# Altium schematic sheet Power_12v.SchDoc
size A
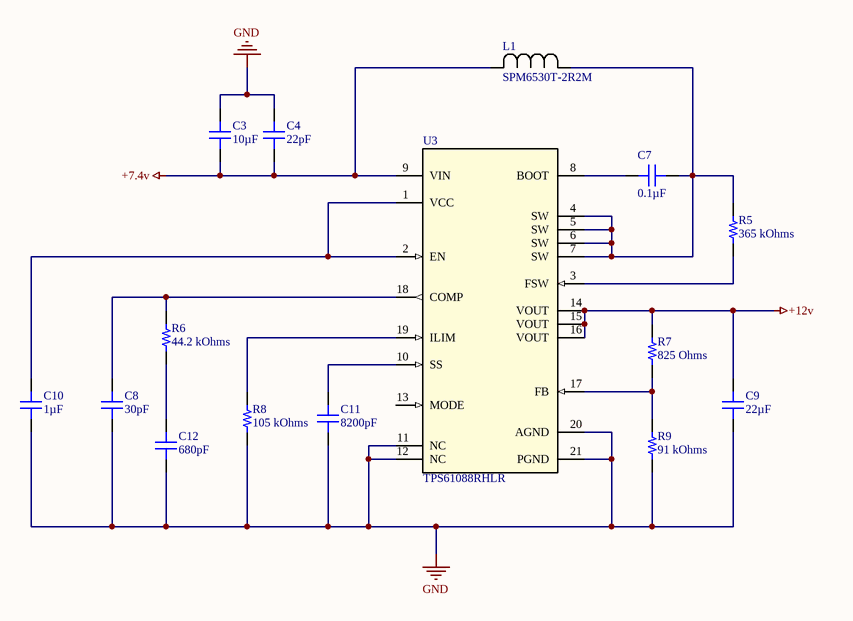
[diagram p0: Power_12v.SchDoc]

## Parts
C3  10µF  [CAP 1210_3225 - 2.8MM]
C4  22pF  [CAP 0603_1608]
C7  0.1µF  [CAP 0603_1608]
C8  value 30pF  [CAP 0603_1608]  (hidden comment: 22pF)
C9  22µF  [CAP 1210_3225 - 2.8MM]
C10  1µF  [CAP 0603_1608]
C11  value 8200pF  [CAP 0603_1608]  (hidden comment: 1µF)
C12  value 680pF  [CAP 0603_1608]  (hidden comment: 470pF)
L1  SPM6530T-2R2M  [IND_SPM6530_TDK]
R5  value 365 kOhms  [RES 0603_1608]  (hidden comment: 267 kOhms)
R6  value 44.2 kOhms  [RES 0603_1608]  (hidden comment: 36.5 kOhms)
R7  value 825 Ohms  [RES 0603_1608]  (hidden comment: 267 kOhms)
R8  105 kOhms  [RES 0603_1608]
R9  value 91 kOhms  [RES 0805_2012]  (hidden comment: 392 kOhms)
U3  TPS61088RHLR  [RHL0020A]

## Nets
+7.4v: C3.1 C4.1 L1.2 U3.9(VIN)
+12v: C9.2 R7.2 U3.14(VOUT) U3.15(VOUT) U3.16(VOUT)
GND: C3.2 C4.2 C8.1 C9.1 C10.1 C11.1 C12.1 R8.1 R9.2 U3.11(NC) U3.12(NC) U3.20(AGND) U3.21(PGND)
NetC7_1: C7.1 U3.8(BOOT)
NetC7_2: C7.2 L1.1 R5.2 U3.4(SW) U3.5(SW) U3.6(SW) U3.7(SW)
NetC8_2: C8.2 R6.2 U3.18(COMP)
NetC10_2: C10.2 U3.1(VCC) U3.2(EN)
NetC11_2: C11.2 U3.10(SS)
NetC12_2: C12.2 R6.1
NetR5_1: R5.1 U3.3(FSW)
NetR7_1: R7.1 R9.1 U3.17(FB)
NetR8_2: R8.2 U3.19(ILIM)

Not connected (* = marked no-connect by the designer): U3 13(MODE)

## Library data of the parts
C3 = GCJ32EC71H106KA01L: CAP CER 10UF 50V X7S 1210; Manufacturer: Murata Electronics; Tolerance: ±10%; Part Number: GCJ32EC71H106KA01L; Value: 10µF; Applications: Automotive, Boardflex Sensitive; Capacitance: 10µF; ComponentLink1Description: Datasheet; ComponentLink1URL: https://search.murata.co.jp/Ceramy/image/img/A01X/G101/ENG/GCJ32EC71H106KA01-01.pdf; ComponentLink2Description: DigiKey Link; ComponentLink2URL: http://digikey.com/product-detail/en/murata-electronics/GCJ32EC71H106KA01L/490-14418-1-ND/6606879; Device Package: 1210 (3225 Metric); Features: Soft Termination; LastUpdated: 9/2/2020 1:10:53 AM; Lifecycle Status: Active; Minimum Order: 1; Mounting Type: Surface Mount, MLCC; Operating Temperature: -55°C ~ 125°C; Package / Case: 1210 (3225 Metric); Packaging: TapeAndReel; PartId: 23622; Part Status: Active; Price: 0.53; Ratings: AEC-Q200; Series: GCJ; Size / Dimension: 0.126" L x 0.098" W (3.20mm x 2.50mm); Supplier 1: DigiKey; Supplier Part Number 1: 490-14418-1-ND; Temperature Coefficient: X7S; Thickness (Max): 0.110" (2.80mm); Voltage - Rated: 50V
C4 = 06033A220KAT2A: CAP CER 22PF 25V C0G/NP0 0603; Manufacturer: AVX Corporation; Temperature Coefficient: C0G, NP0; Tolerance: ±10%; Part Number: 06033A220KAT2A; Value: 22pF; Applications: General Purpose; Capacitance: 22pF; ComponentLink1Description: Datasheet; ComponentLink1URL: http://datasheets.avx.com/C0GNP0-Dielectric.pdf; ComponentLink2Description: DigiKey Link; ComponentLink2URL: http://digikey.com/product-detail/en/avx-corporation/06033A220KAT2A/478-11803-1-ND/8573439; Device Package: 0603 (1608 Metric); LastUpdated: 9/2/2020 1:03:34 AM; Lifecycle Status: Active; Minimum Order: 1; Mounting Type: Surface Mount, MLCC; Operating Temperature: -55°C ~ 125°C; Package / Case: 0603 (1608 Metric); Packaging: TapeAndReel; PartId: 3017; Part Status: Active; Price: 0.04; Series: -; Size / Dimension: 0.063" L x 0.032" W (1.60mm x 0.81mm); Supplier 1: DigiKey; Supplier Part Number 1: 478-11803-1-ND; Thickness (Max): 0.035" (0.90mm); Voltage - Rated: 25V
C7 = 0603YC104JAT4A: CAP CER 0.1UF 16V X7R 0603; Manufacturer: AVX Corporation; Tolerance: ±5%; Part Number: 0603YC104JAT4A; Value: 0.1µF; Applications: General Purpose; Capacitance: 0.1µF; ComponentLink1Description: Datasheet; ComponentLink1URL: http://datasheets.avx.com/X7RDielectric.pdf; ComponentLink2Description: DigiKey Link; ComponentLink2URL: http://digikey.com/product-detail/en/avx-corporation/0603YC104JAT4A/478-7621-1-ND/7536239; Device Package: 0603 (1608 Metric); LastUpdated: 9/2/2020 1:03:19 AM; Lifecycle Status: Active; Minimum Order: 1; Mounting Type: Surface Mount, MLCC; Operating Temperature: -55°C ~ 125°C; Package / Case: 0603 (1608 Metric); Packaging: TapeAndReel; PartId: 11638; Part Status: Active; Price: 0.03; Series: -; Size / Dimension: 0.063" L x 0.032" W (1.60mm x 0.81mm); Supplier 1: DigiKey; Supplier Part Number 1: 478-7621-1-ND; Temperature Coefficient: X7R; Thickness (Max): 0.035" (0.90mm); Voltage - Rated: 16V
C8 = C0805C300J5GACTU: CAP CER 30PF 50V C0G/NP0 0805; Manufacturer: KEMET; Temperature Coefficient: C0G, NP0; Tolerance: ±5%; Part Number: C0805C300J5GACTU; Applications: General Purpose; Capacitance: 30pF; ComponentLink1Description: Datasheet; ComponentLink1URL: https://api.kemet.com/component-edge/download/datasheet/C0805C300J5GACTU.pdf; ComponentLink2Description: DigiKey Link; ComponentLink2URL: http://digikey.com/product-detail/en/kemet/C0805C300J5GACTU/399-9219-1-ND/3522737; Device Package: 0805 (2012 Metric); Features: Low ESL; LastUpdated: 9/2/2020 1:04:20 AM; Lifecycle Status: Active; Minimum Order: 1; Mounting Type: Surface Mount, MLCC; Operating Temperature: -55°C ~ 125°C; Package / Case: 0805 (2012 Metric); Packaging: TapeAndReel; PartId: 14047; Part Status: Active; Price: 0.06; Series: SMD Comm C0G; Size / Dimension: 0.079" L x 0.049" W (2.00mm x 1.25mm); Supplier 1: DigiKey; Supplier Part Number 1: 399-9219-1-ND; Thickness (Max): 0.035" (0.88mm); Voltage - Rated: 50V
C9 = GRM32ER71E226ME15K: CAP CER 22UF 25V X7R 1210; Manufacturer: Murata Electronics; Tolerance: ±20%; Part Number: GRM32ER71E226ME15K; Value: 22µF; Applications: General Purpose; Capacitance: 22µF; ComponentLink1Description: Datasheet; ComponentLink1URL: https://search.murata.co.jp/Ceramy/image/img/A01X/G101/ENG/GRM32ER71E226ME15-01.pdf; ComponentLink2Description: DigiKey Link; ComponentLink2URL: http://digikey.com/product-detail/en/murata-electronics/GRM32ER71E226ME15K/490-14682-1-ND/6606288; Device Package: 1210 (3225 Metric); LastUpdated: 9/2/2020 1:10:50 AM; Lifecycle Status: Active; Minimum Order: 1; Mounting Type: Surface Mount, MLCC; Operating Temperature: -55°C ~ 125°C; Package / Case: 1210 (3225 Metric); Packaging: TapeAndReel; PartId: 24019; Part Status: Active; Price: 0.35; Series: GRM; Size / Dimension: 0.126" L x 0.098" W (3.20mm x 2.50mm); Supplier 1: DigiKey; Supplier Part Number 1: 490-14682-1-ND; Temperature Coefficient: X7R; Thickness (Max): 0.106" (2.70mm); Voltage - Rated: 25V
C10 = C0603C105K4PACTU: CAP CER 1UF 16V X5R 0603; Manufacturer: KEMET; Tolerance: ±10%; Part Number: C0603C105K4PACTU; Value: 1µF; Applications: General Purpose; Capacitance: 1µF; ComponentLink1Description: Datasheet; ComponentLink1URL: https://api.kemet.com/component-edge/download/datasheet/C0603C105K4PACTU.pdf; ComponentLink2Description: DigiKey Link; ComponentLink2URL: http://digikey.com/product-detail/en/kemet/C0603C105K4PACTU/399-5090-1-ND/1465624; Device Package: 0603 (1608 Metric); LastUpdated: 9/2/2020 1:03:33 AM; Lifecycle Status: Active; Minimum Order: 1; Mounting Type: Surface Mount, MLCC; Operating Temperature: -55°C ~ 85°C; Package / Case: 0603 (1608 Metric); Packaging: TapeAndReel; PartId: 3768; Part Status: Active; Price: 0.02; Series: SMD Comm X5R; Size / Dimension: 0.063" L x 0.031" W (1.60mm x 0.80mm); Supplier 1: DigiKey; Supplier Part Number 1: 399-5090-1-ND; Temperature Coefficient: X5R; Thickness (Max): 0.035" (0.90mm); Voltage - Rated: 16V
C11 = CDR31BX822AKUS7185: CAP CER 8200PF 50V BX 0805; Manufacturer: KEMET; Tolerance: ±10%; Part Number: CDR31BX822AKUS7185; Applications: High Reliability; Capacitance: 8200pF; ComponentLink1Description: Datasheet; ComponentLink1URL: https://content.kemet.com/datasheets/F3102_MIL-PRF-55681.pdf; ComponentLink2Description: DigiKey Link; ComponentLink2URL: http://digikey.com/product-detail/en/kemet/CDR31BX822AKUS7185/1001-2399-1-ND/3738615; Device Package: 0805 (2012 Metric); Failure Rate: S (0.001%); LastUpdated: 9/2/2020 1:04:33 AM; Lifecycle Status: Active; Minimum Order: 1; Mounting Type: Surface Mount, MLCC; Operating Temperature: -55°C ~ 125°C; Package / Case: 0805 (2012 Metric); Packaging: TapeAndReel; PartId: 7255; Part Status: Active; Price: 0.86; Series: Military, MIL-PRF-55681, CDR31; Size / Dimension: 0.079" L x 0.049" W (2.00mm x 1.25mm); Supplier 1: DigiKey; Supplier Part Number 1: 1001-2399-1-ND; Temperature Coefficient: BX; Thickness (Max): 0.051" (1.30mm); Voltage - Rated: 50V
C12 = CC0805JRNPO9BN681: CAP CER 680PF 50V C0G/NPO 0805; Manufacturer: Yageo; Temperature Coefficient: C0G, NP0; Tolerance: ±5%; Part Number: CC0805JRNPO9BN681; Applications: General Purpose; Capacitance: 680pF; ComponentLink1Description: Datasheet; ComponentLink1URL: https://www.yageo.com/upload/media/product/productsearch/datasheet/mlcc/UPY-GP_NP0_16V-to-50V_17.pdf; ComponentLink2Description: DigiKey Link; ComponentLink2URL: http://digikey.com/product-detail/en/yageo/CC0805JRNPO9BN681/311-1121-1-ND/303031; Device Package: 0805 (2012 Metric); Features: High Voltage; LastUpdated: 9/2/2020 1:04:42 AM; Lifecycle Status: Active; Minimum Order: 1; Mounting Type: Surface Mount, MLCC; Operating Temperature: -55°C ~ 125°C; Package / Case: 0805 (2012 Metric); Packaging: TapeAndReel; PartId: 2491; Part Status: Active; Price: 0.02; Series: CC; Size / Dimension: 0.079" L x 0.049" W (2.00mm x 1.25mm); Supplier 1: DigiKey; Supplier Part Number 1: 311-1121-1-ND; Thickness (Max): 0.024" (0.60mm); Voltage - Rated: 50V
L1 = SPM6530T-2R2M: No Description Available; Vendor: TDK; Built_By: EMA_UL_Team; SourceLibrary: TDK_2015_05_22; Manufacturer_Part_Number: SPM6530T-2R2M; Copyright: Copyright (C) 2018 Accelerated Designs. All rights reserved
R5 = RC0805FR-07365KL: RES SMD 365K OHM 1% 1/8W 0805; Manufacturer: Yageo; Power (Watts): 0.125W, 1/8W; Temperature Coefficient: ±100ppm/°C; Part Number: RC0805FR-07365KL; ComponentLink1Description: Datasheet; ComponentLink1URL: https://www.yageo.com/upload/media/product/productsearch/datasheet/rchip/PYu-RC_Group_51_RoHS_L_10.pdf; ComponentLink2Description: DigiKey Link; ComponentLink2URL: http://digikey.com/product-detail/en/yageo/RC0805FR-07365KL/311-365KCRCT-ND/730836; Composition: Thick Film; Device Package: 0805 (2012 Metric); Features: Moisture Resistant; Height - Seated (Max): 0.024" (0.60mm); LastUpdated: 9/2/2020 1:14:46 AM; Lifecycle Status: Active; Minimum Order: 1; Number of Terminations: 2; Operating Temperature: -55°C ~ 155°C; Package / Case: 0805 (2012 Metric); Packaging: CutTape; PartId: 45039; Part Status: Active; Price: 0.10; Resistance: 365 kOhms; Series: RC; Size / Dimension: 0.079" L x 0.049" W (2.00mm x 1.25mm); Supplier 1: DigiKey; Supplier Part Number 1: 311-365KCRCT-ND; Supplier Device Package: 0805; Tolerance: ±1%
R6 = KTR10EZPF4422: RES SMD 44.2K OHM 1% 1/8W 0805; Manufacturer: Rohm Semiconductor; Power (Watts): 0.125W, 1/8W; Temperature Coefficient: ±100ppm/°C; Part Number: KTR10EZPF4422; ComponentLink1Description: Datasheet; ComponentLink1URL: https://www.rohm.com/datasheet/KTR03EZPF/ktr-e; ComponentLink2Description: DigiKey Link; ComponentLink2URL: http://digikey.com/product-detail/en/rohm-semiconductor/KTR10EZPF4422/RHM44.2KAHCT-ND/4054582; Composition: Thick Film; Device Package: 0805 (2012 Metric); Features: Automotive AEC-Q200, High Voltage; Height - Seated (Max): 0.026" (0.65mm); LastUpdated: 9/2/2020 1:15:21 AM; Lifecycle Status: Active; Minimum Order: 1; Number of Terminations: 2; Operating Temperature: -55°C ~ 155°C; Package / Case: 0805 (2012 Metric); Packaging: TapeAndReel; PartId: 29064; Part Status: Active; Price: 0.02; Ratings: AEC-Q200; Resistance: 44.2 kOhms; Series: KTR; Size / Dimension: 0.079" L x 0.049" W (2.00mm x 1.25mm); Supplier 1: DigiKey; Supplier Part Number 1: RHM44.2KAHCT-ND; Supplier Device Package: 0805; Tolerance: ±1%
R7 = RMCF0805FT825R: RES 825 OHM 1% 1/8W 0805; Manufacturer: Stackpole Electronics Inc; Power (Watts): 0.125W, 1/8W; Temperature Coefficient: ±100ppm/°C; Part Number: RMCF0805FT825R; ComponentLink1Description: Datasheet; ComponentLink1URL: https://www.seielect.com/catalog/sei-rmcf_rmcp.pdf; ComponentLink2Description: DigiKey Link; ComponentLink2URL: http://digikey.com/product-detail/en/stackpole-electronics-inc/RMCF0805FT825R/RMCF0805FT825RCT-ND/1942368; Composition: Thick Film; Device Package: 0805 (2012 Metric); Features: Automotive AEC-Q200; Height - Seated (Max): 0.026" (0.65mm); LastUpdated: 9/2/2020 1:14:59 AM; Lifecycle Status: Active; Minimum Order: 1; Number of Terminations: 2; Operating Temperature: -55°C ~ 155°C; Package / Case: 0805 (2012 Metric); Packaging: CutTape; PartId: 38939; Part Status: Active; Price: 0.10; Ratings: AEC-Q200; Resistance: 825 Ohms; Series: RMCF; Size / Dimension: 0.079" L x 0.049" W (2.00mm x 1.25mm); Supplier 1: DigiKey; Supplier Part Number 1: RMCF0805FT825RCT-ND; Supplier Device Package: 0805; Tolerance: ±1%
R8 = RC0603FR-07105KL: RES SMD 105K OHM 1% 1/10W 0603; Manufacturer: Yageo; Power (Watts): 0.1W, 1/10W; Temperature Coefficient: ±100ppm/°C; Part Number: RC0603FR-07105KL; Value: 105 kOhms; ComponentLink1Description: Datasheet; ComponentLink1URL: https://www.yageo.com/upload/media/product/productsearch/datasheet/rchip/PYu-RC_Group_51_RoHS_L_10.pdf; ComponentLink2Description: DigiKey Link; ComponentLink2URL: http://digikey.com/product-detail/en/yageo/RC0603FR-07105KL/311-105KHRCT-ND/729840; Composition: Thick Film; Device Package: 0603 (1608 Metric); Features: Moisture Resistant; Height - Seated (Max): 0.022" (0.55mm); LastUpdated: 9/2/2020 1:10:19 AM; Lifecycle Status: Active; Minimum Order: 1; Number of Terminations: 2; Operating Temperature: -55°C ~ 155°C; Package / Case: 0603 (1608 Metric); Packaging: CutTape; PartId: 7511; Part Status: Active; Price: 0.10; Resistance: 105 kOhms; Series: RC; Size / Dimension: 0.063" L x 0.031" W (1.60mm x 0.80mm); Supplier 1: DigiKey; Supplier Part Number 1: 311-105KHRCT-ND; Supplier Device Package: 0603; Tolerance: ±1%
R9 = CRCW080591K0JNEA: RES SMD 91K OHM 5% 1/8W 0805; Manufacturer: Vishay Dale; Power (Watts): 0.125W, 1/8W; Temperature Coefficient: ±200ppm/°C; Part Number: CRCW080591K0JNEA; ComponentLink1Description: Datasheet; ComponentLink1URL: http://www.vishay.com/docs/20035/dcrcwe3.pdf; ComponentLink2Description: DigiKey Link; ComponentLink2URL: http://digikey.com/product-detail/en/vishay-dale/CRCW080591K0JNEA/541-91KACT-ND/1180387; Composition: Thick Film; Device Package: 0805 (2012 Metric); Features: Automotive AEC-Q200; Height - Seated (Max): 0.020" (0.50mm); LastUpdated: 9/2/2020 1:14:34 AM; Lifecycle Status: Active; Minimum Order: 1; Number of Terminations: 2; Operating Temperature: -55°C ~ 155°C; Package / Case: 0805 (2012 Metric); Packaging: CutTape; PartId: 48020; Part Status: Active; Price: 0.10; Ratings: AEC-Q200; Resistance: 91 kOhms; Series: CRCW; Size / Dimension: 0.079" L x 0.049" W (2.00mm x 1.25mm); Supplier 1: DigiKey; Supplier Part Number 1: 541-91KACT-ND; Supplier Device Package: 0805; Tolerance: ±5%
U3 = TPS61088RHLR: No Description Available; Alternate_PartNumber: TPS61088RHLT; Manufacturer: Texas Instruments; CompType: IC; PIN_COUNT: 21; Application_BuildNumber: *; PartNumber: TPS61088RHLR; PackageReference: RHL0020A; MountType: SMT; RoHS: Y; RefDes: RefDes; Type: DEV; Value: Value; Copyright: Copyright (C) 2018 Accelerated Designs. All rights reserved